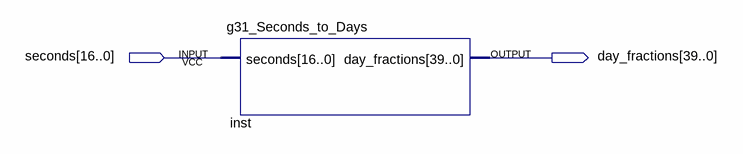
[diagram p0: schematic sheet]
// Quartus schematic g31_lab1.bdf as structural Verilog: 1 symbols, 2 pins
module g31_lab1 (
  input  [16:0] seconds,
  output [39:0] day_fractions
);

  g31_Seconds_to_Days inst (.seconds(seconds), .day_fractions(day_fractions));
endmodule
